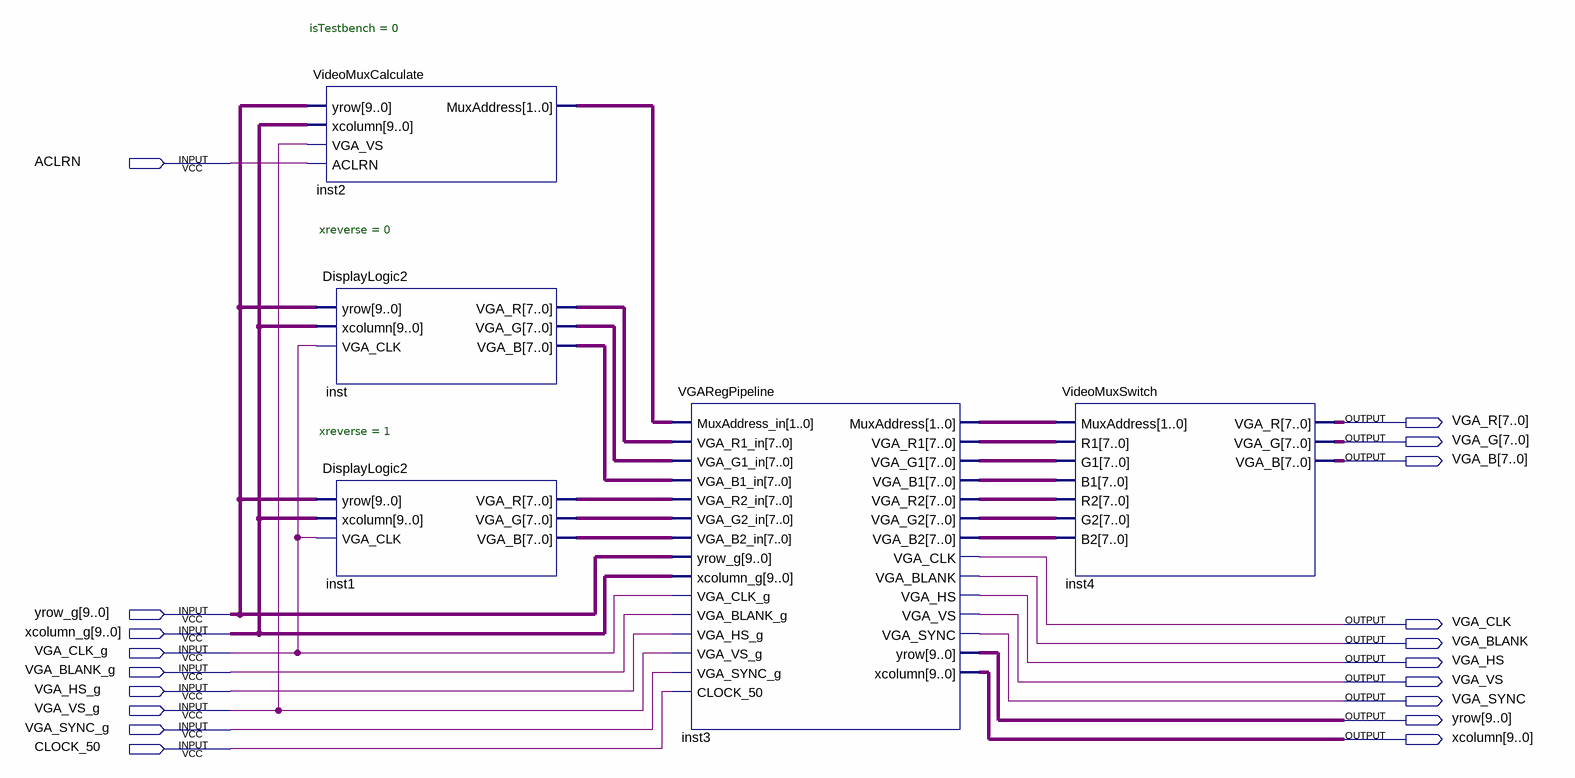
[diagram p0: schematic sheet]
// Quartus schematic DisplayLogic2Mux_BDF.bdf as structural Verilog: 5 symbols, 19 pins
module DisplayLogic2Mux_BDF (
  input  ACLRN,
  input  [9:0] yrow_g,
  input  [9:0] xcolumn_g,
  input  VGA_CLK_g,
  input  VGA_BLANK_g,
  input  VGA_HS_g,
  input  VGA_VS_g,
  input  VGA_SYNC_g,
  input  CLOCK_50,
  output [7:0] VGA_R,
  output [7:0] VGA_G,
  output [7:0] VGA_B,
  output VGA_CLK,
  output VGA_BLANK,
  output VGA_HS,
  output VGA_VS,
  output VGA_SYNC,
  output [9:0] yrow,
  output [9:0] xcolumn
);

  wire [1:0] inst2_muxaddress, inst3_muxaddress;
  wire [7:0] inst1_vga_b, inst1_vga_g, inst1_vga_r, inst3_vga_b1, inst3_vga_b2, inst3_vga_g1, inst3_vga_g2,
       inst3_vga_r1, inst3_vga_r2, inst_vga_b, inst_vga_g, inst_vga_r;

  VideoMuxCalculate #(.isTestbench(0)) inst2 (
    .yrow(yrow_g), .xcolumn(xcolumn_g), .VGA_VS(VGA_VS_g), .ACLRN(ACLRN), .MuxAddress(inst2_muxaddress));
  DisplayLogic2 #(.xreverse(0)) inst (
    .yrow(yrow_g), .xcolumn(xcolumn_g), .VGA_CLK(VGA_CLK_g), .VGA_R(inst_vga_r), .VGA_G(inst_vga_g),
    .VGA_B(inst_vga_b));
  DisplayLogic2 #(.xreverse(1)) inst1 (
    .yrow(yrow_g), .xcolumn(xcolumn_g), .VGA_CLK(VGA_CLK_g), .VGA_R(inst1_vga_r), .VGA_G(inst1_vga_g),
    .VGA_B(inst1_vga_b));
  VGARegPipeline inst3 (
    .MuxAddress_in(inst2_muxaddress), .VGA_R1_in(inst_vga_r), .VGA_G1_in(inst_vga_g), .VGA_B1_in(inst_vga_b),
    .VGA_R2_in(inst1_vga_r), .VGA_G2_in(inst1_vga_g), .VGA_B2_in(inst1_vga_b), .yrow_g(yrow_g),
    .xcolumn_g(xcolumn_g), .VGA_CLK_g(VGA_CLK_g), .VGA_BLANK_g(VGA_BLANK_g), .VGA_HS_g(VGA_HS_g),
    .VGA_VS_g(VGA_VS_g), .VGA_SYNC_g(VGA_SYNC_g), .CLOCK_50(CLOCK_50), .MuxAddress(inst3_muxaddress),
    .VGA_R1(inst3_vga_r1), .VGA_G1(inst3_vga_g1), .VGA_B1(inst3_vga_b1), .VGA_R2(inst3_vga_r2),
    .VGA_G2(inst3_vga_g2), .VGA_B2(inst3_vga_b2), .VGA_CLK(VGA_CLK), .VGA_BLANK(VGA_BLANK), .VGA_HS(VGA_HS),
    .VGA_VS(VGA_VS), .VGA_SYNC(VGA_SYNC), .yrow(yrow), .xcolumn(xcolumn));
  VideoMuxSwitch inst4 (
    .MuxAddress(inst3_muxaddress), .R1(inst3_vga_r1), .G1(inst3_vga_g1), .B1(inst3_vga_b1),
    .R2(inst3_vga_r2), .G2(inst3_vga_g2), .B2(inst3_vga_b2), .VGA_R(VGA_R), .VGA_G(VGA_G), .VGA_B(VGA_B));
endmodule
